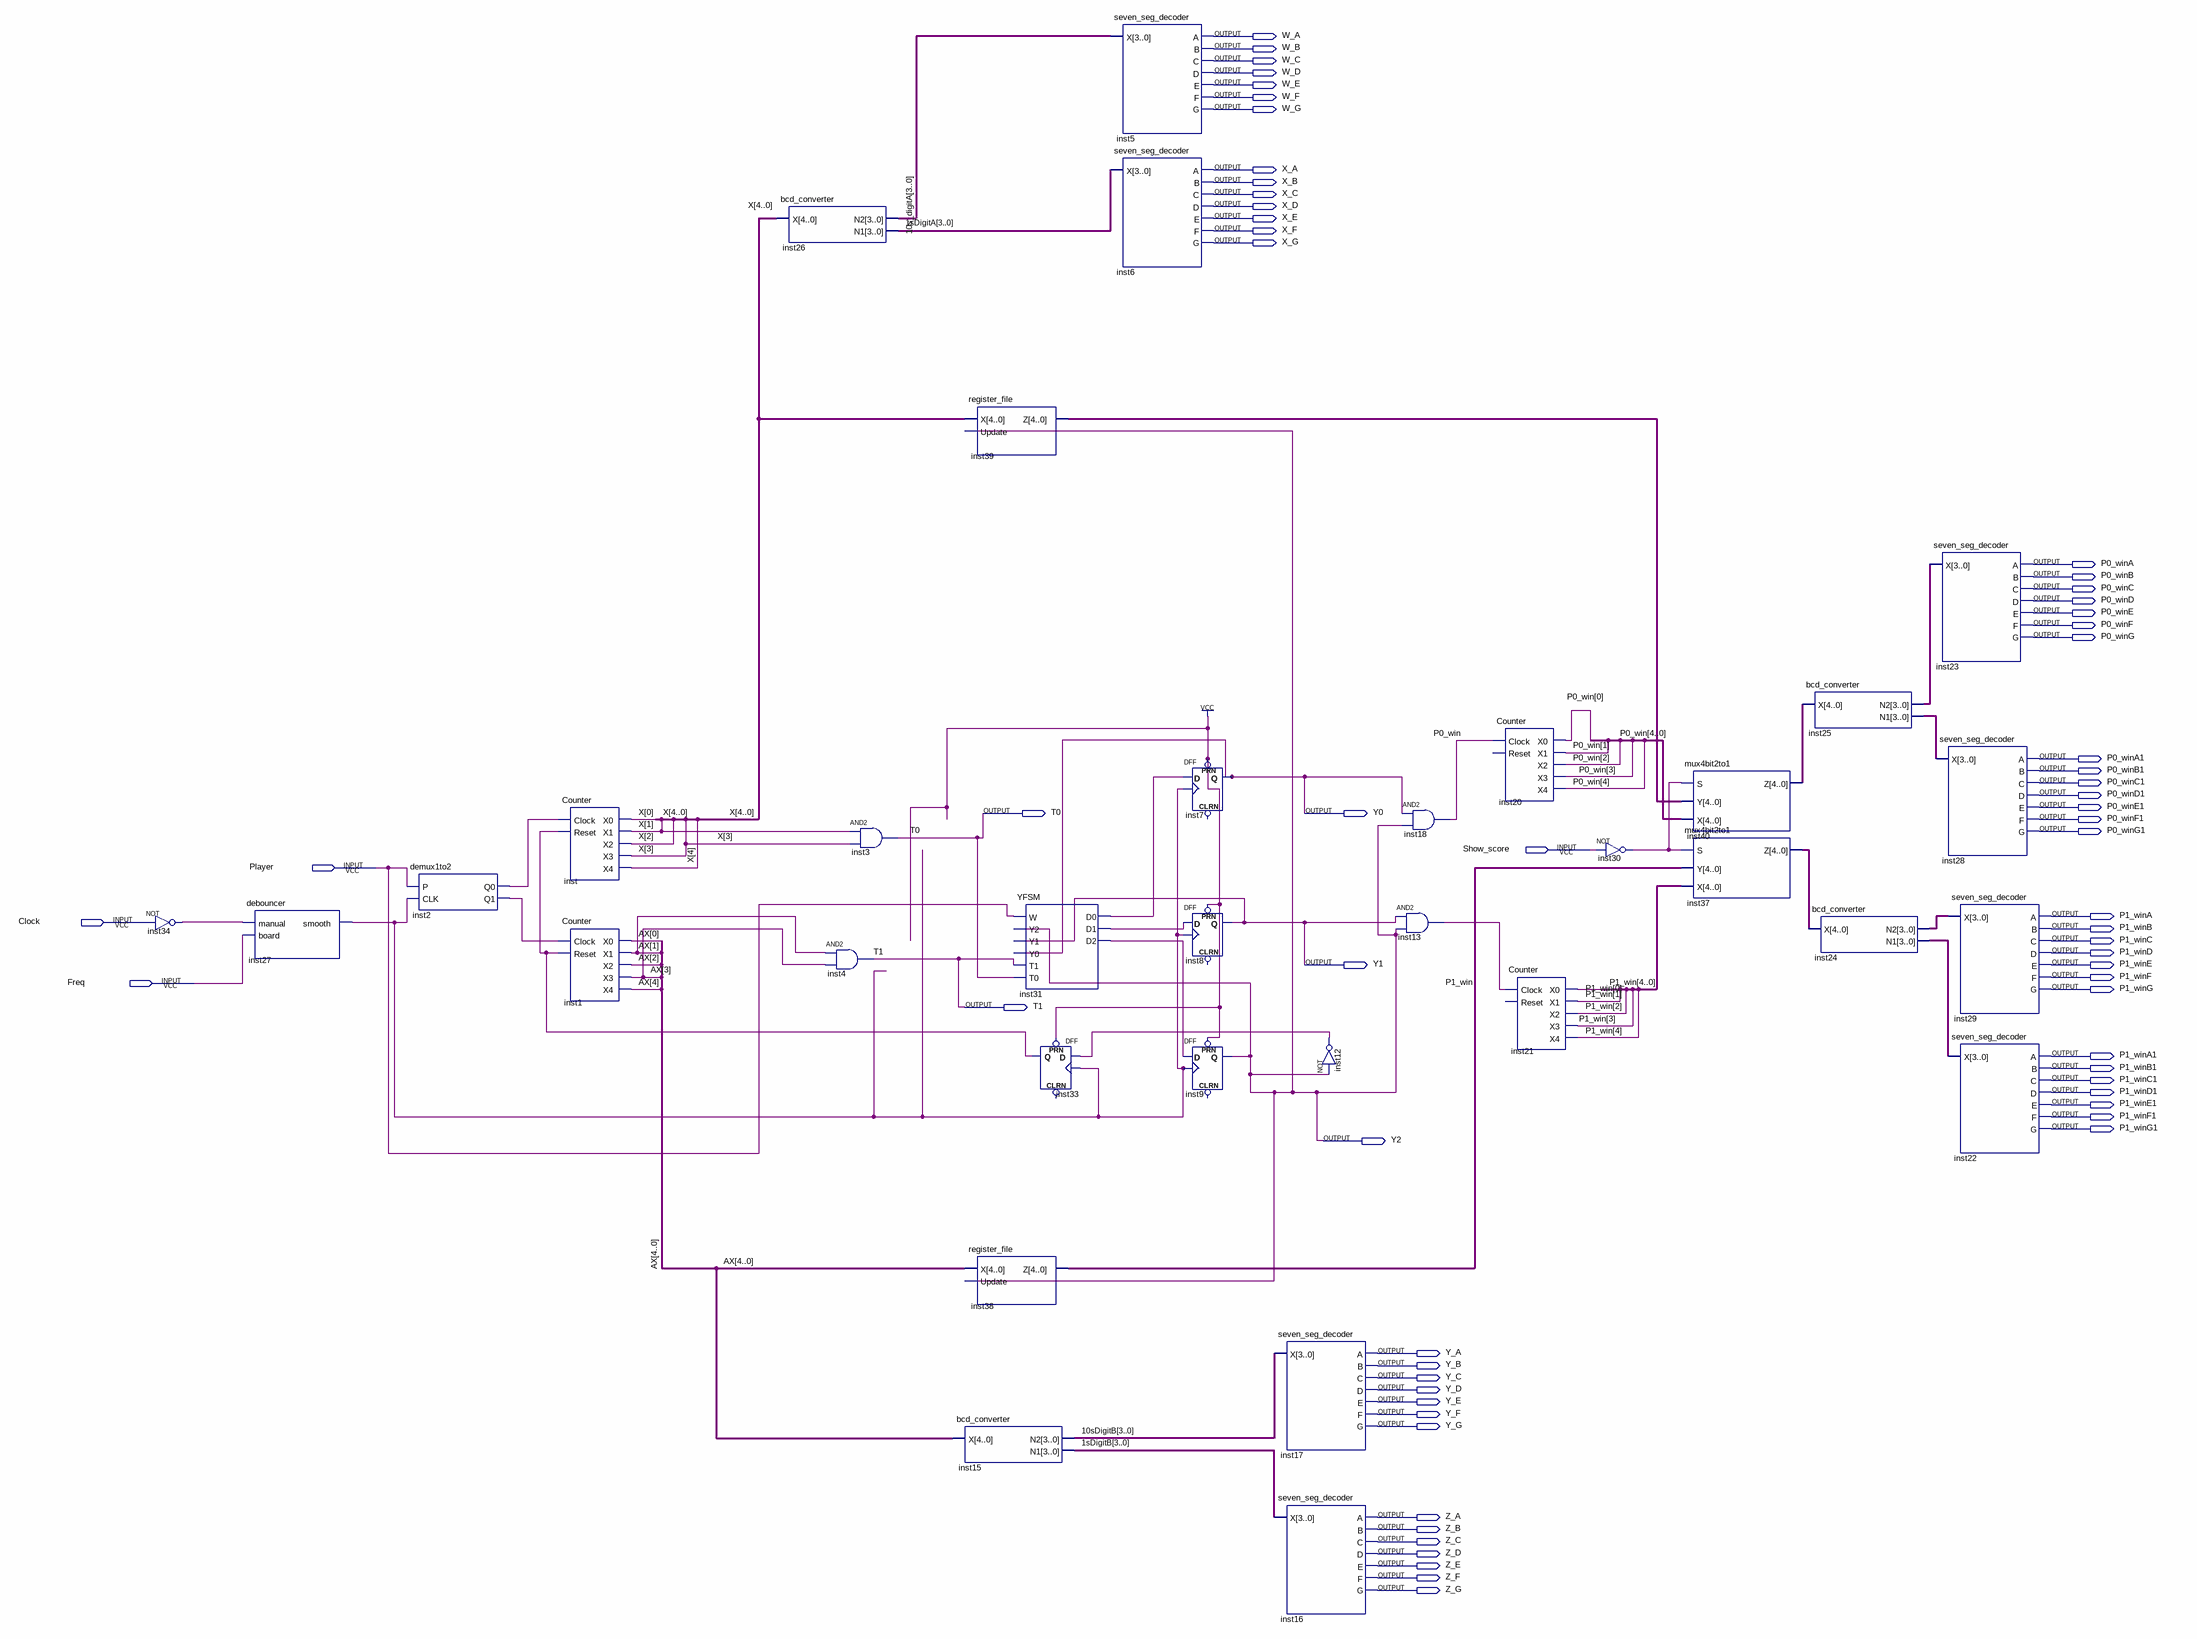
[diagram p0: schematic sheet]
// Quartus schematic Main_Design.bdf as structural Verilog: 34 symbols, 65 pins
module Main_Design (
  input  Show_score,
  input  Player,
  input  Clock,
  input  Freq,
  output W_A,
  output W_B,
  output W_C,
  output W_D,
  output W_E,
  output W_F,
  output W_G,
  output X_A,
  output X_B,
  output X_C,
  output X_D,
  output X_E,
  output X_F,
  output X_G,
  output P0_winA,
  output P0_winB,
  output P0_winC,
  output P0_winD,
  output P0_winE,
  output P0_winF,
  output P0_winG,
  output P0_winA1,
  output P0_winB1,
  output P0_winC1,
  output P0_winD1,
  output P0_winE1,
  output T0,
  output Y0,
  output P0_winF1,
  output P0_winG1,
  output P1_winA,
  output P1_winB,
  output P1_winC,
  output P1_winD,
  output Y1,
  output P1_winE,
  output P1_winF,
  output P1_winG,
  output T1,
  output P1_winA1,
  output P1_winB1,
  output P1_winC1,
  output P1_winD1,
  output P1_winE1,
  output P1_winF1,
  output P1_winG1,
  output Y2,
  output Y_A,
  output Y_B,
  output Y_C,
  output Y_D,
  output Y_E,
  output Y_F,
  output Y_G,
  output Z_A,
  output Z_B,
  output Z_C,
  output Z_D,
  output Z_E,
  output Z_F,
  output Z_G
);

  wire inst2_q0, inst2_q1, inst12_out, inst27_smooth, inst30_out, inst31_d0, inst31_d1, inst31_d2, inst33_q,
       inst34_out, P0_win_1bit, P1_win_1bit;
  wire [3:0] \1sDigitA , \1sDigitB , \10s_digitA , \10sDigitB , inst24_n1, inst24_n2, inst25_n1, inst25_n2;
  wire [4:0] AX, inst37_z, inst38_z, inst39_z, inst40_z, P0_win, P1_win, X;

  not inst34 (inst34_out, Clock);
  debouncer inst27 (.manual(inst34_out), .board(Freq), .smooth(inst27_smooth));
  demux1to2 inst2 (.CLK(inst27_smooth), .P(Player), .Q0(inst2_q0), .Q1(inst2_q1));
  Counter inst (.Clock(inst2_q0), .Reset(inst33_q), .X0(X[0]), .X1(X[1]), .X2(X[2]), .X3(X[3]), .X4(X[4]));
  Counter inst1 (.Clock(inst2_q1), .Reset(inst33_q), .X0(AX[0]), .X1(AX[1]), .X2(AX[2]), .X3(AX[3]), .X4(AX[4]));
  bcd_converter inst26 (.X(X), .N2(\10s_digitA ), .N1(\1sDigitA ));
  and inst3 (T0, X[1], X[3]);
  and inst4 (T1, AX[1], AX[3]);
  register_file inst39 (.X(X), .Update(Y2), .Z(inst39_z));
  register_file inst38 (.X(AX), .Update(Y2), .Z(inst38_z));
  bcd_converter inst15 (.X(AX), .N2(\10sDigitB ), .N1(\1sDigitB ));
  YFSM inst31 (.W(Player), .Y2(Y2), .Y1(Y1), .Y0(Y0), .T1(T1), .T0(T0), .D0(inst31_d0), .D1(inst31_d1), .D2(inst31_d2));
  DFF inst33 (.CLK(inst27_smooth), .D(inst12_out), .PRN(1'b1), .Q(inst33_q));  // open: CLRN
  seven_seg_decoder inst5 (.X(\10s_digitA ), .A(W_A), .B(W_B), .C(W_C), .D(W_D), .E(W_E), .F(W_F), .G(W_G));
  seven_seg_decoder inst6 (.X(\1sDigitA ), .A(X_A), .B(X_B), .C(X_C), .D(X_D), .E(X_E), .F(X_F), .G(X_G));
  DFF inst7 (.CLK(inst27_smooth), .D(inst31_d0), .PRN(1'b1), .Q(Y0));  // open: CLRN
  DFF inst8 (.CLK(inst27_smooth), .D(inst31_d1), .PRN(1'b1), .Q(Y1));  // open: CLRN
  DFF inst9 (.CLK(inst27_smooth), .D(inst31_d2), .PRN(1'b1), .Q(Y2));  // open: CLRN
  seven_seg_decoder inst17 (.X(\10sDigitB ), .A(Y_A), .B(Y_B), .C(Y_C), .D(Y_D), .E(Y_E), .F(Y_F), .G(Y_G));
  seven_seg_decoder inst16 (.X(\1sDigitB ), .A(Z_A), .B(Z_B), .C(Z_C), .D(Z_D), .E(Z_E), .F(Z_F), .G(Z_G));
  not inst12 (inst12_out, Y2);
  and inst18 (P0_win_1bit, Y0, Y2);
  and inst13 (P1_win_1bit, Y1, Y2);
  Counter inst20 (
    .Clock(P0_win_1bit), .X0(P0_win[0]), .X1(P0_win[1]), .X2(P0_win[2]), .X3(P0_win[3]), .X4(P0_win[4]));  // open: Reset
  Counter inst21 (
    .Clock(P1_win_1bit), .X0(P1_win[0]), .X1(P1_win[1]), .X2(P1_win[2]), .X3(P1_win[3]), .X4(P1_win[4]));  // open: Reset
  not inst30 (inst30_out, Show_score);
  mux4bit2to1 inst40 (.X(P0_win), .Y(inst39_z), .S(inst30_out), .Z(inst40_z));
  mux4bit2to1 inst37 (.X(P1_win), .Y(inst38_z), .S(inst30_out), .Z(inst37_z));
  bcd_converter inst25 (.X(inst40_z), .N2(inst25_n2), .N1(inst25_n1));
  bcd_converter inst24 (.X(inst37_z), .N2(inst24_n2), .N1(inst24_n1));
  seven_seg_decoder inst23 (
    .X(inst25_n2), .A(P0_winA), .B(P0_winB), .C(P0_winC), .D(P0_winD), .E(P0_winE), .F(P0_winF), .G(P0_winG));
  seven_seg_decoder inst28 (
    .X(inst25_n1), .A(P0_winA1), .B(P0_winB1), .C(P0_winC1), .D(P0_winD1), .E(P0_winE1), .F(P0_winF1),
    .G(P0_winG1));
  seven_seg_decoder inst29 (
    .X(inst24_n2), .A(P1_winA), .B(P1_winB), .C(P1_winC), .D(P1_winD), .E(P1_winE), .F(P1_winF), .G(P1_winG));
  seven_seg_decoder inst22 (
    .X(inst24_n1), .A(P1_winA1), .B(P1_winB1), .C(P1_winC1), .D(P1_winD1), .E(P1_winE1), .F(P1_winF1),
    .G(P1_winG1));
endmodule
